# EAGLE design bk (EAGLE 5.11)
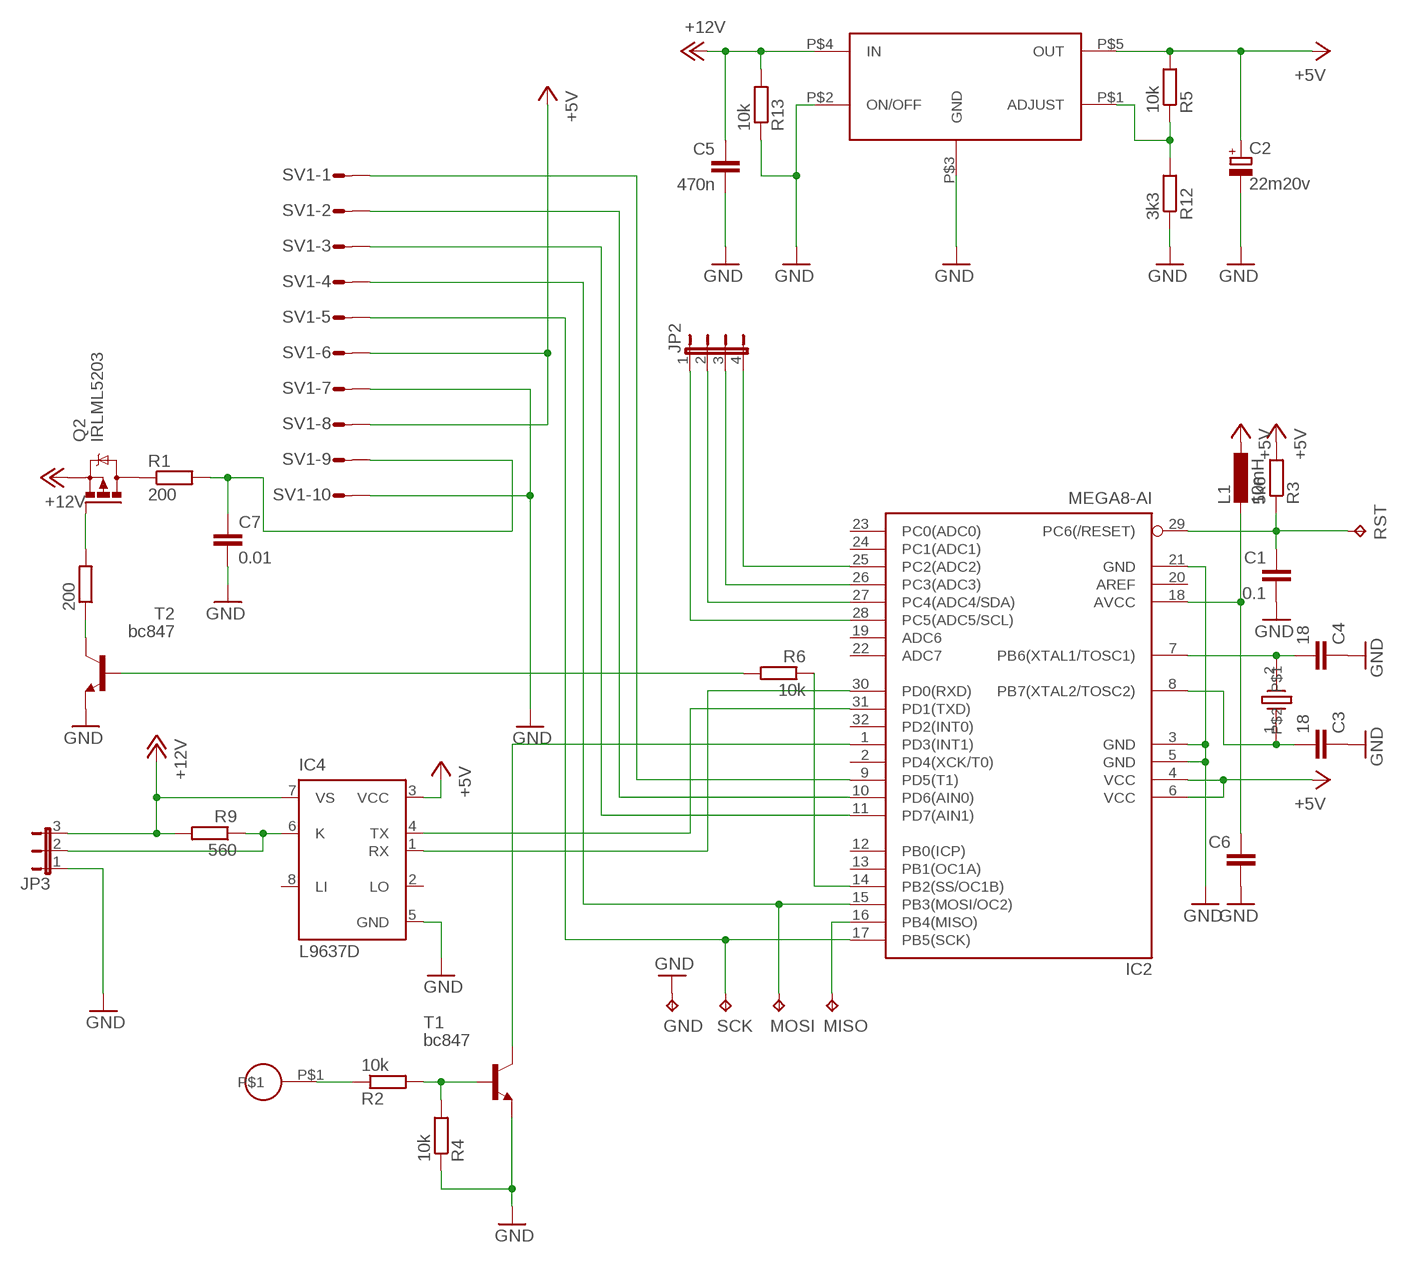
[diagram p0: schematic, sheet 1]

## Parts
200  R-EU_R0603  [R0603]
C1  0.1  C-EUC0603K  [C0603K]
C2  22m20v  CPOL-EU085CS-1AR  [085CS_1AR]
C3  18  C-EUC0603K  [C0603K]
C4  18  C-EUC0603K  [C0603K]
C5  470n  C-EUC0603K  [C0603K]
C6  C-EUC0603K  [C0603K]
C7  0.01  C-EUC0603K  [C0603K]
GND  TPB1,27  [B1,27]
IC2  MEGA8-AI  [TQFP32-08]
IC4  L9637D  [SO08]
JP2  JP4E  [JP4]
JP3  JP2E  [JP2]
L1  10mH  L-EUL3216C  [L3216C]
MISO  TPB1,27  [B1,27]
MOSI  TPB1,27  [B1,27]
Q2  IRLML5203  [MICRO3]
R1  200  R-EU_R0603  [R0603]
R2  10k  R-EU_R0603  [R0603]
R3  5k6  R-EU_R0603  [R0603]
R4  10k  R-EU_R0603  [R0603]
R5  10k  R-EU_R0603  [R0603]
R6  10k  R-EU_R0603  [R0603]
R9  560  R-EU_R0603  [R0603]
R12  3k3  R-EU_R0603  [R0603]
R13  10k  R-EU_R0603  [R0603]
RST  TPB1,27  [B1,27]
SCK  TPB1,27  [B1,27]
SV1  L10P  [L10P]
T1  bc847  BC817-16-NPN-SOT23-BEC  [SOT23-BEC]
T2  bc847  BC817-16-NPN-SOT23-BEC  [SOT23-BEC]
U$1  LM2941  [LM2941S]
U$2  16Mhz  NX3225SA  [NX3225SA]
U$3  PAD  [PAD]

## Nets
+5V: C2.+ IC2.4(VCC) IC2.6(VCC) IC4.3(VCC) L1.1 R3.2 R5.2 SV1.6 SV1.8 U$1.P$5(OUT)
+12V: C5.1 IC4.7(VS) JP3.3 Q2.2(S) R9.2 R13.2 U$1.P$4(IN)
GND: C1.2 C2.- C3.1 C4.1 C5.2 C6.2 C7.2 GND.TP IC2.3(GND) IC2.5(GND) IC2.21(GND) IC4.5(GND) JP3.1 R4.1 R12.1 R13.1 SV1.7 SV1.10 T1.E T2.E U$1.P$2(ON/OFF) U$1.P$3(GND)
LCD_CS: IC2.11(PD7(AIN1)) SV1.3
LCD_DAT: IC2.17(PB5(SCK)) SCK.TP SV1.5
LCD_RESET: IC2.10(PD6(AIN0)) SV1.2
LCD_RS: IC2.9(PD5(T1)) SV1.1
LCD_SCK: IC2.15(PB3(MOSI/OC2)) MOSI.TP SV1.4
MCU_RXD: IC2.30(PD0(RXD)) IC4.1(RX)
MCU_TXD: IC2.31(PD1(TXD)) IC4.4(TX)
N$1: IC4.6(K) JP3.2 R9.1
N$2: C7.1 R1.2 SV1.9
N$3: IC2.14(PB2(SS/OC1B)) R6.1
N$4: C4.2 IC2.7(PB6(XTAL1/TOSC1)) U$2.2
N$5: Q2.3(D) R1.1
N$6: R6.2 T2.B
N$7: R2.2 R4.2 T1.B
N$8: R2.1 U$3.P$1
N$9: IC2.1(PD3(INT1)) T1.C
N$10: R5.1 R12.2 U$1.P$1(ADJUST)
N$12: 200.1 T2.C
N$13: 200.2 Q2.1(G)
N$15: IC2.16(PB4(MISO)) MISO.TP
N$16: C6.1 IC2.18(AVCC) L1.2
N$19: IC2.25(PC2(ADC2)) JP2.4
N$20: IC2.26(PC3(ADC3)) JP2.3
N$21: IC2.27(PC4(ADC4/SDA)) JP2.2
N$22: IC2.28(PC5(ADC5/SCL)) JP2.1
N$24: C3.2 IC2.8(PB7(XTAL2/TOSC2)) U$2.1
RST: C1.1 IC2.29(PC6(/RESET)) R3.1 RST.TP
Unconnected: IC2.2(PD4(XCK/T0)) IC2.12(PB0(ICP)) IC2.13(PB1(OC1A)) IC2.19(ADC6) IC2.20(AREF) IC2.22(ADC7) IC2.23(PC0(ADC0)) IC2.24(PC1(ADC1)) IC2.32(PD2(INT0)) IC4.2(LO) IC4.8(LI)

## Library data of the parts
200 R1-R6 R9 R12 R13 = rcl:R-EU_: RESISTOR, European symbol
C1 C3-C7 = rcl:C-EU: CAPACITOR, European symbol
C2 = rcl:CPOL-EU: POLARIZED CAPACITOR, European symbol
GND MISO MOSI RST SCK = testpad:TP: Test pad
IC2 = atmel:MEGA8: MICROCONTROLLER 8 Kbytes FLASH, 1 kbytes SRAM, 512 bytes EEPROM, USART, 6-channel 10 bit ADC, 2-channel 8 bit ADC Pin compatible with Atmega48, ATMega88, ATMega168 Source: avr.lbr; MPN: ATMEGA8-16AU; OC_FARNELL: 9171371; OC_NEWARK: 73M8863
IC4 = st-microelectronics:L9637D: ISO 9141 INTERFACE Source: 1765.pdf; MPN: L9637D; OC_FARNELL: unknown; OC_NEWARK: 56P8926
JP2 = jumper:JP4E: JUMPER
JP3 = jumper:JP2E: JUMPER
L1 = rcl:L-EU: INDUCTOR, European symbol
Q2 = transistor-power:IRLML5203: HEXFET P-Channel Power MOSFET
SV1 = con-amp-mt:L10P: AMP MT CONNECTOR; OC_FARNELL: unknown; OC_NEWARK: unknown
T1 T2 = transistor:*-NPN-: NPN Transistror BF959 corrected 2008.03.06
U$1 = my_analog:LM2941
U$2 = my_analog:NX3225SA
U$3 = my_analog:PAD

## Board
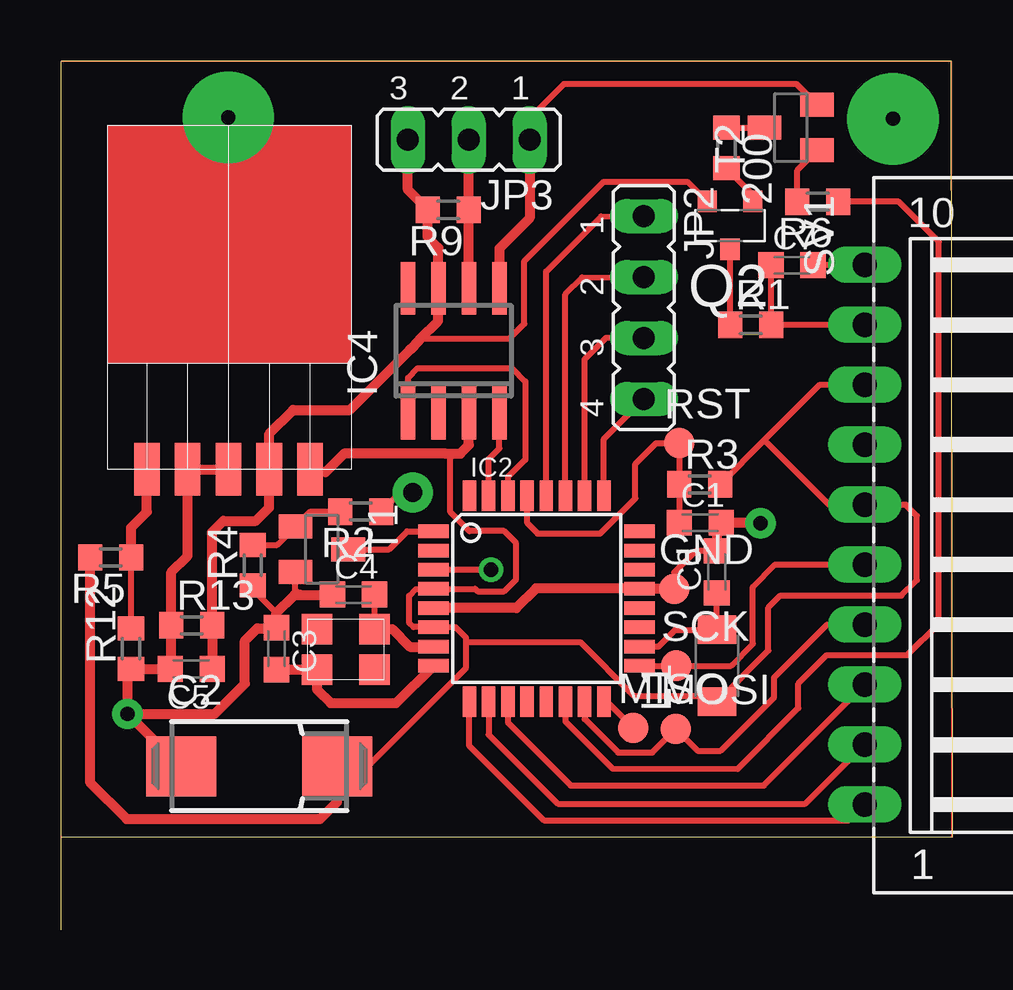
[diagram p1: board, top side]
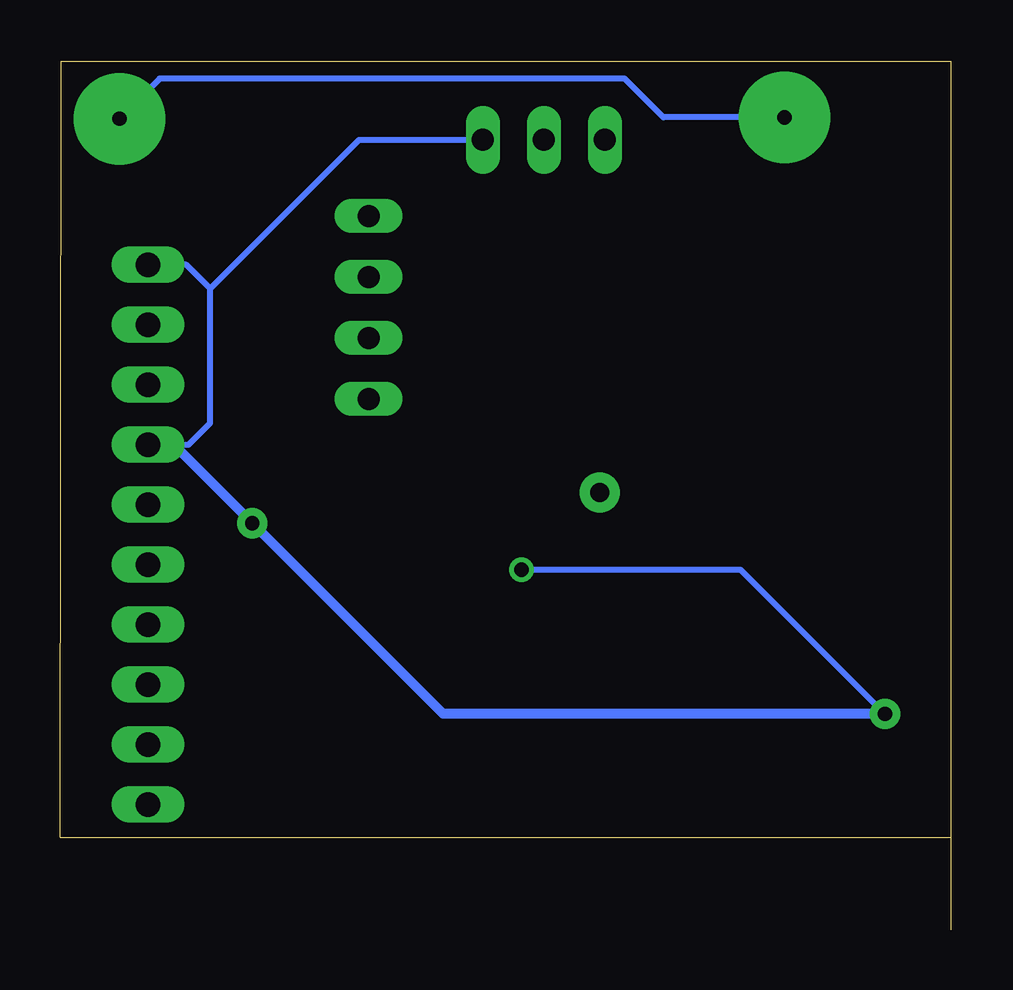
[diagram p2: board, bottom side, seen from below]

Size 37.15 x 36.21 mm. Coordinates in mm from the lower left corner, seen from the top.
Outline: 0,0 0.01,3.85
Outline: 0.01,3.85 37.15,3.85 37.09,36.21 0.01,36.21 0.01,3.85
Copper layers (1*16): Top 0.035mm / dielectric 1.5mm / Bottom 0.035mm
Design rules "default": minimum track width 10mil, minimum drill 24mil, track to track 8mil, track to pad 8mil, pad to pad 8mil, via to via 8mil, smd to smd 8mil, copper to edge 40mil, drill to drill 8mil, minimum pad ring 10mil, minimum via ring 8mil, stop-mask expansion 4mil, vias tented up to drill 0mil, thermal gap 10mil

### Footprints (pad centres in the part's own frame; a part is rotated, then mirrored left to right if it is on the bottom)
R0603 = smd 1 x 1.1: 1 -0.85,0; 2 0.85,0
C0603K = smd 1.05 x 1.08: 1 -0.875,0; 2 0.875,0
085CS_1AR = smd 2.9 x 2.5: + 3.25,0; - -3.25,0
B1,27 = smd 1.27 x 1.27: TP 0,0
TQFP32-08 = smd 1.27 x 0.559: 1 -4.293,2.8; 2 -4.293,2; 3 -4.293,1.2; 4 -4.293,0.4; 5 -4.293,-0.4; 6 -4.293,-1.2; 7 -4.293,-2; 8 -4.293,-2.8; 17 4.293,-2.8; 18 4.293,-2; 19 4.293,-1.2; 20 4.293,-0.4; 21 4.293,0.4; 22 4.293,1.2; 23 4.293,2; 24 4.293,2.8 | smd 0.559 x 1.27: 9 -2.8,-4.293; 10 -2,-4.293; 11 -1.2,-4.293; 12 -0.4,-4.293; 13 0.4,-4.293; 14 1.2,-4.293; 15 2,-4.293; 16 2.8,-4.293; 25 2.8,4.293; 26 2,4.293; 27 1.2,4.293; 28 0.4,4.293; 29 -0.4,4.293; 30 -1.2,4.293; 31 -2,4.293; 32 -2.8,4.293
SO08 = smd 0.6 x 2.2: 1 -1.905,-2.6; 2 -0.635,-2.6; 3 0.635,-2.6; 4 1.905,-2.6; 5 1.905,2.6; 6 0.635,2.6; 7 -0.635,2.6; 8 -1.905,2.6
JP4 = drill 0.914 long: 1 -3.81,0; 2 -1.27,0; 3 1.27,0; 4 3.81,0
JP2 = drill 0.914 long: 1 -2.54,0; 2 0,0; 3 2.54,0
L3216C = smd 1.2 x 1.6: 1 -1.5,0; 2 1.5,0
MICRO3 = smd 0.8 x 0.9: 1 -0.95,-1; 2 0.95,-1; 3 0,1
L10P = drill 1.016 long: 1 11.25,-6.25; 2 8.75,-6.25; 3 6.25,-6.25; 4 3.75,-6.25; 5 1.25,-6.25; 6 -1.25,-6.25; 7 -3.75,-6.25; 8 -6.25,-6.25; 9 -8.75,-6.25; 10 -11.25,-6.25
SOT23-BEC = smd 1 x 1.4: B -0.95,-1.1; C 0,1.1; E 0.95,-1.1
LM2941S = smd 1.067 x 2.184: P$1 1.64,0; P$2 3.34,0; P$3 5.04,0; P$4 6.74,0; P$5 8.44,0
NX3225SA = smd 1.27 x 1.27: 1 0.4,0.4; 2 2.8,2.1; NC1 0.4,2.1; NC2 2.8,0.4
PAD = drill 0.8 pad 1.676 round: P$1 0,0

### Placement (x,y rotation side)
200  27.72,32.59 270 top
C1  26.63,16.97 0 top
C2  8.26,6.82 0 top
C3  8.98,11.72 270 top
C4  12.19,13.97 0 top
C5  5.42,10.87 180 top
C6  27.32,14.92 90 top
C7  30.45,27.7 0 top
GND  25.54,14.21 0 top
IC2  19.81,13.81 0 top
IC4  16.36,24.14 0 top
JP2  24.29,25.94 270 top
JP3  16.98,32.93 180 top
L1  27.33,11.01 90 top
MISO  23.84,8.41 0 top
MOSI  25.61,8.37 0 top
Q2  27.88,29.36 180 top
R1  28.73,25.22 0 top
R2  12.49,17.43 180 top
R3  26.61,18.57 0 top
R4  7.99,15.2 90 top
R5  2.06,15.52 180 top
R6  31.52,30.35 180 top
R9  16.13,30.01 180 top
R12  2.92,11.72 90 top
R13  5.45,12.69 0 top
RST  25.77,20.29 0 top
SCK  25.62,11.01 0 top
SV1  39.73,16.47 270 top
T1  10.87,15.86 270 top
T2  30.4,33.44 90 top
U$1  1.93,19.19 0 top
U$2  10.26,10.44 0 top
U$3  14.66,18.23 0 top

### Tracks (layer width: path | path; a pad name or v marks a point on that pad's centre or on a via)
+5V
  Top 0.254: 10.4,19.21 U$1.P$5 10.49,19.08 | 16.88,12.07 16.88,10.92 12.78,6.82 | 16.88,12.07 16.88,12.17 16.43,12.61 IC2.6 15.51,12.62 14.69,12.62 14.51,12.8 14.51,13.92 14.79,14.2 IC2.4 17.25,14.21 17.36,14.11 18.46,14.11 18.96,14.61 18.96,16.12 18.46,16.62 17.02,16.62 16.22,17.41 16.22,19.65 16.02,19.85 | R5.2 | 12.78,6.82 12.84,6.82 | C2.+ 12.78,6.82 | 16.88,12.07 16.95,11.99 21.62,11.99 23.86,9.75 27.09,9.75 L1.1 29.47,11.64 29.47,13.43 29.97,13.93 35.02,13.93 35.66,14.57 35.66,17.25 35.2,17.71 SV1.6 31.99,17.72 29.3,20.41 | SV1.8 31.61,22.72 29.3,20.41 | 29.3,20.41 R3.2
  Top 0.406: R5.2 1.22,6.13 2.73,4.62 10.79,4.62 11.5,5.32 C2.+ | 10.49,19.08 11.03,19.08 11.79,19.85 16.02,19.85 16.63,19.85 16.99,20.21 IC4.3
+12V
  Top 0.254: U$1.P$4 8.7,19.17 | Q2.2 26.11,31.18 22.61,31.18 19.3,27.88 19.3,25.27 18.67,24.64 14.97,24.64
  Top 0.406: C5.1 R13.2 6.29,16.58 6.76,17.05 8.12,17.05 8.67,17.6 U$1.P$4 8.68,20.68 9.67,21.67 12.03,21.67 14.54,24.19 14.93,24.59 14.97,24.64 15.72,25.38 IC4.7 15.72,28.43 15.29,28.86 R9.2 14.45,30.85 JP3.3
GND  (via drill 0.6 pad 1.02, 0.6 pad 1.27)
  Top 0.254: C3.1 | U$1.P$3 7,19.17 | IC2.21 | GND.TP 25.54,14.89 26.45,15.79 C6.2 | U$1.P$2 | C7.2 33.47,27.7 SV1.10 | T1.E 9.77,14.16 9.97,13.96 | R4.1 7.99,14.19 8.98,13.2 | v17.91,15.01 IC2.3 | T2.E 30.62,35.27 20.95,35.27 19.52,33.84 JP3.1
  Top 0.406: v2.77,9 6.41,9 7.66,10.25 7.66,12.05 8.18,12.57 8.95,12.57 C3.1 8.98,13.2 9.74,13.96 9.97,13.96 C4.1 | v2.77,9 2.77,10.73 R12.1 C5.2 4.59,10.91 R13.1 | IC2.5 18.97,13.41 19.79,14.23 24.09,14.23 IC2.21 GND.TP | C2.- 4.96,6.82 v2.77,9 | IC4.5 18.26,28.41 19.52,29.67 JP3.1 | 27.53,16.95 C1.2 | v29.13,16.95 27.53,16.95 | 27.53,16.95 27.32,16.75 C6.2 | R13.1 4.81,12.91 | R13.1 4.59,14.91 5.27,15.59 U$1.P$2 U$1.P$3
  Bottom 0.254: SV1.10 31.88,27.72 30.88,26.73 | 30.88,26.73 30.88,21.12 31.79,20.22 SV1.7 | 30.88,26.73 24.68,32.93 JP3.1 | v17.91,15.01 8.79,15.01 v2.77,9
  Bottom 0.406: SV1.7 32.41,20.22 v29.13,16.95 21.18,9 v2.77,9
LCD_CS
  Top 0.254: IC2.11 18.61,8.64 21.23,6.02 29.29,6.02 SV1.3
LCD_DAT
  Top 0.254: IC2.17 SCK.TP 27.91,11.01 28.82,11.92 28.82,14.3 29.74,15.22 SV1.5
LCD_RESET
  Top 0.254: IC2.10 17.81,8.13 20.7,5.25 31.02,5.25 SV1.2
LCD_RS
  Top 0.254: IC2.9 17.02,7.66 20.11,4.57 32.84,4.57 SV1.1
LCD_SCK
  Top 0.254: IC2.15 21.81,8.79 23.21,7.39 24.63,7.39 MOSI.TP 26.52,7.46 27.48,7.46 29.71,9.69 29.71,10.52 31.91,12.72 SV1.4
MCU_RXD
  Top 0.254: IC2.30 18.61,18.87 19.34,19.6 19.34,22.86 18.79,23.41 14.85,23.41 14.46,23.02 IC4.1
MCU_TXD
  Top 0.254: IC4.4 18.26,20.07 17.81,19.62 IC2.31
N$1
  Top 0.406: IC4.6 R9.1 JP3.2
N$2
  Top 0.254: SV1.9 R1.2 C7.1
N$3
  Top 0.254: IC2.14 21.02,8.68 22.97,6.72 28.18,6.7 30.72,9.24 30.72,10.27 31.9,11.45 35.27,11.45 36.58,12.76 36.58,28.68 34.91,30.35 R6.1
N$4
  Top 0.254: C4.2 U$2.2 13.08,12.52
  Top 0.406: U$2.2 13.79,12.54 14.54,11.8 15.51,11.8 IC2.7
N$5
  Top 0.254: Q2.3 R1.1
N$6
  Top 0.254: R6.2 30.68,31.66 T2.B
N$7
  Top 0.254: R4.2 9.01,16.05 T1.B 10.39,17.43 R2.2
N$8
  Top 0.254: R2.1 14.14,18.23 U$3.P$1
N$9
  Top 0.254: IC2.1 14.42,16.61 13.67,15.86 T1.C
N$10
  Top 0.254: R12.2 R5.1 | 3.55,19.21 U$1.P$1
  Top 0.406: R5.1 2.92,16.76 3.57,17.42 U$1.P$1
N$11
  Top 0.05: 0.03,3.86 37.09,3.86 37.09,36.21 0.01,36.21 0.01,3.86
N$12
  Top 0.254: 200.1 T2.C
N$13
  Top 0.254: Q2.1 28.82,30.64 200.2
N$15
  Top 0.254: IC2.16 22.74,9.52 MISO.TP
N$16
  Top 0.254: IC2.18 24.89,11.81 25.59,12.51 L1.2 C6.1
N$19
  Top 0.254: IC2.25 22.61,20.46 JP2.4
N$20
  Top 0.254: IC2.26 21.81,23.79 22.7,24.68 JP2.3
N$21
  Top 0.254: IC2.27 21.02,26.49 21.71,27.19 JP2.2
N$22
  Top 0.254: IC2.28 20.21,27.44 22.5,29.73 JP2.1
N$24
  Top 0.406: C3.2 U$2.1 10.66,10.03 11.24,9.45 13.96,9.45 IC2.8
N$32  (via drill 0.6 pad 3.81)
  Bottom 0.254: v6.96,33.87 12.01,33.87 13.62,35.48 33,35.48 v34.66,33.81
RST
  Top 0.254: IC2.29 19.43,16.95 19.86,16.52 22.46,16.52 23.93,17.98 23.93,19.42 24.79,20.29 RST.TP R3.1 C1.1